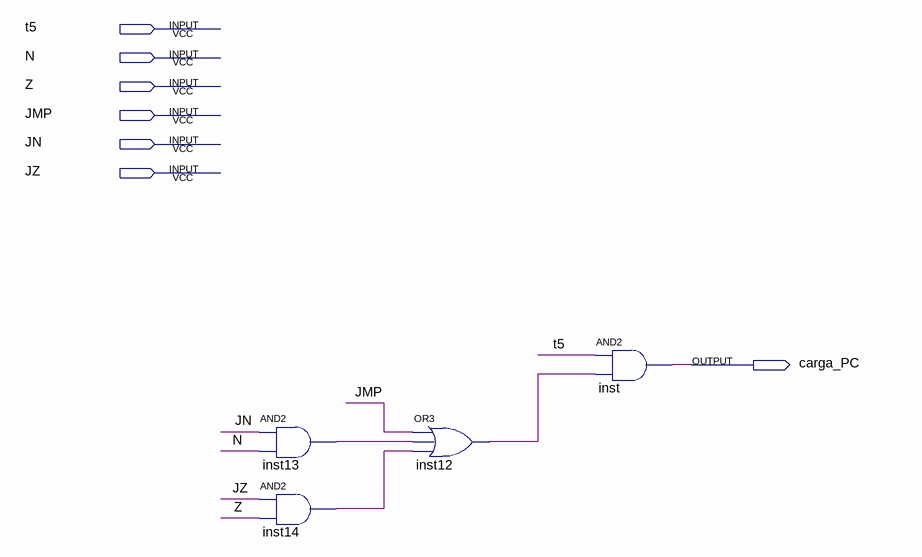
[diagram p0: schematic sheet]
// Quartus schematic carga_PC.bdf as structural Verilog: 4 symbols, 7 pins
module carga_PC (
  input  t5,
  input  N,
  input  Z,
  input  JMP,
  input  JN,
  input  JZ,
  output carga_PC
);

  wire inst12_out, inst13_out, inst14_out;

  and inst13 (inst13_out, JN, N);
  and inst14 (inst14_out, JZ, Z);
  or inst12 (inst12_out, JMP, inst13_out, inst14_out);
  and inst (carga_PC, t5, inst12_out);
endmodule
